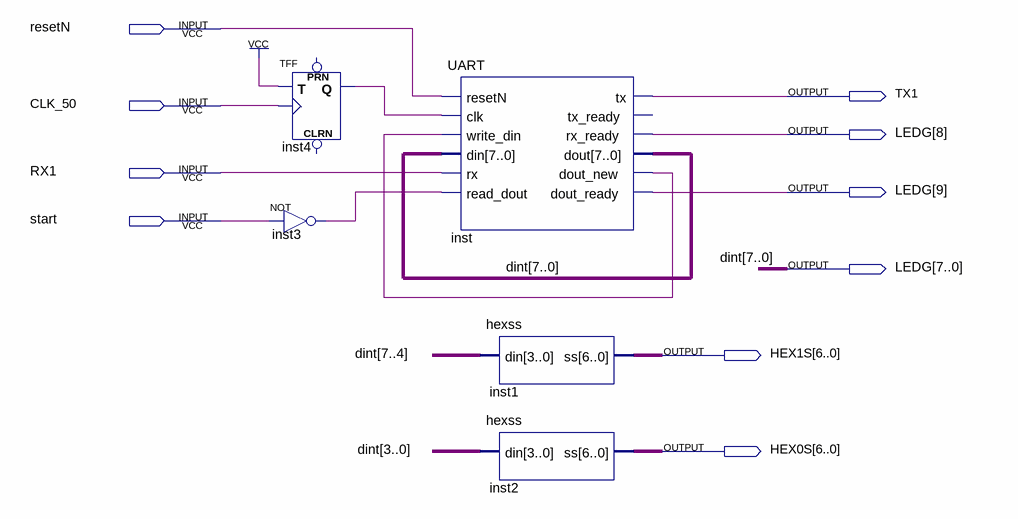
[diagram p0: schematic sheet]
// Quartus schematic test_uart.bdf as structural Verilog: 5 symbols, 10 pins
module test_uart (
  input  resetN,
  input  CLK_50,
  input  RX1,
  input  start,
  output TX1,
  output [9:0] LEDG,
  output [6:0] HEX1S,
  output [6:0] HEX0S
);

  wire inst3_out, inst4_q, inst_dout_new;

  TFF inst4 (.T(1'b1), .CLK(CLK_50), .Q(inst4_q));  // open: PRN, CLRN
  not inst3 (inst3_out, start);
  UART inst (
    .resetN(resetN), .clk(inst4_q), .write_din(inst_dout_new), .din(LEDG[7:0]), .rx(RX1),
    .read_dout(inst3_out), .tx(TX1), .rx_ready(LEDG[8]), .dout(LEDG[7:0]), .dout_new(inst_dout_new),
    .dout_ready(LEDG[9]));  // open: tx_ready
  hexss inst1 (.din(LEDG[7:4]), .ss(HEX1S));
  hexss inst2 (.din(LEDG[3:0]), .ss(HEX0S));

  // Other names for the same wires on the sheet: dint[7:0] = LEDG[7:0]
endmodule
